# EAGLE design eagle (EAGLE 9.6.2)
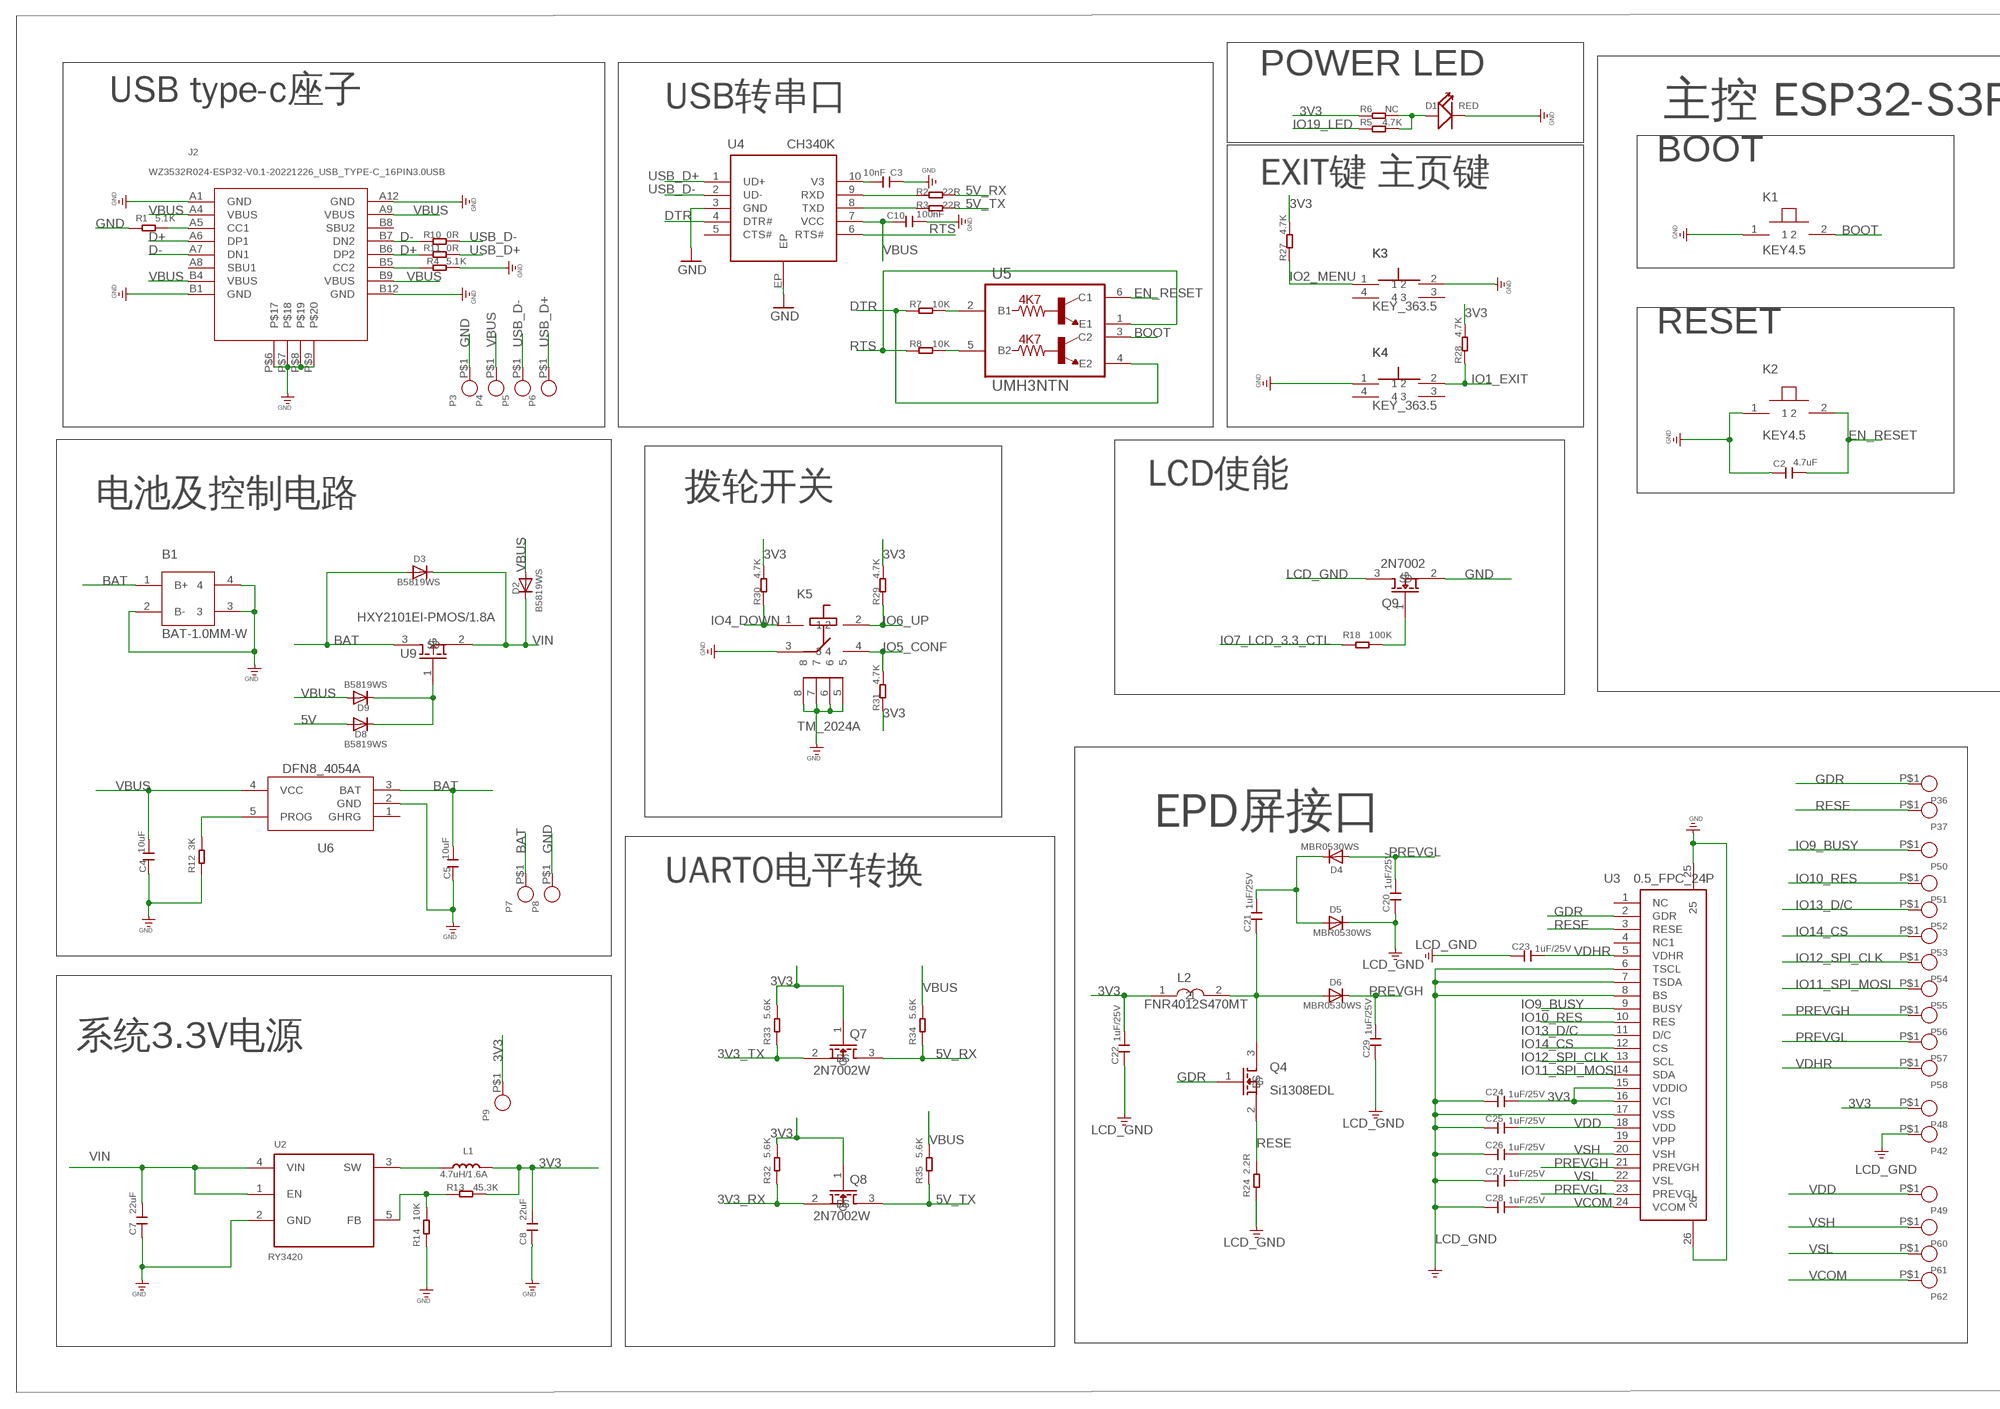
[diagram p0: schematic, sheet 1, part 1 of 2]
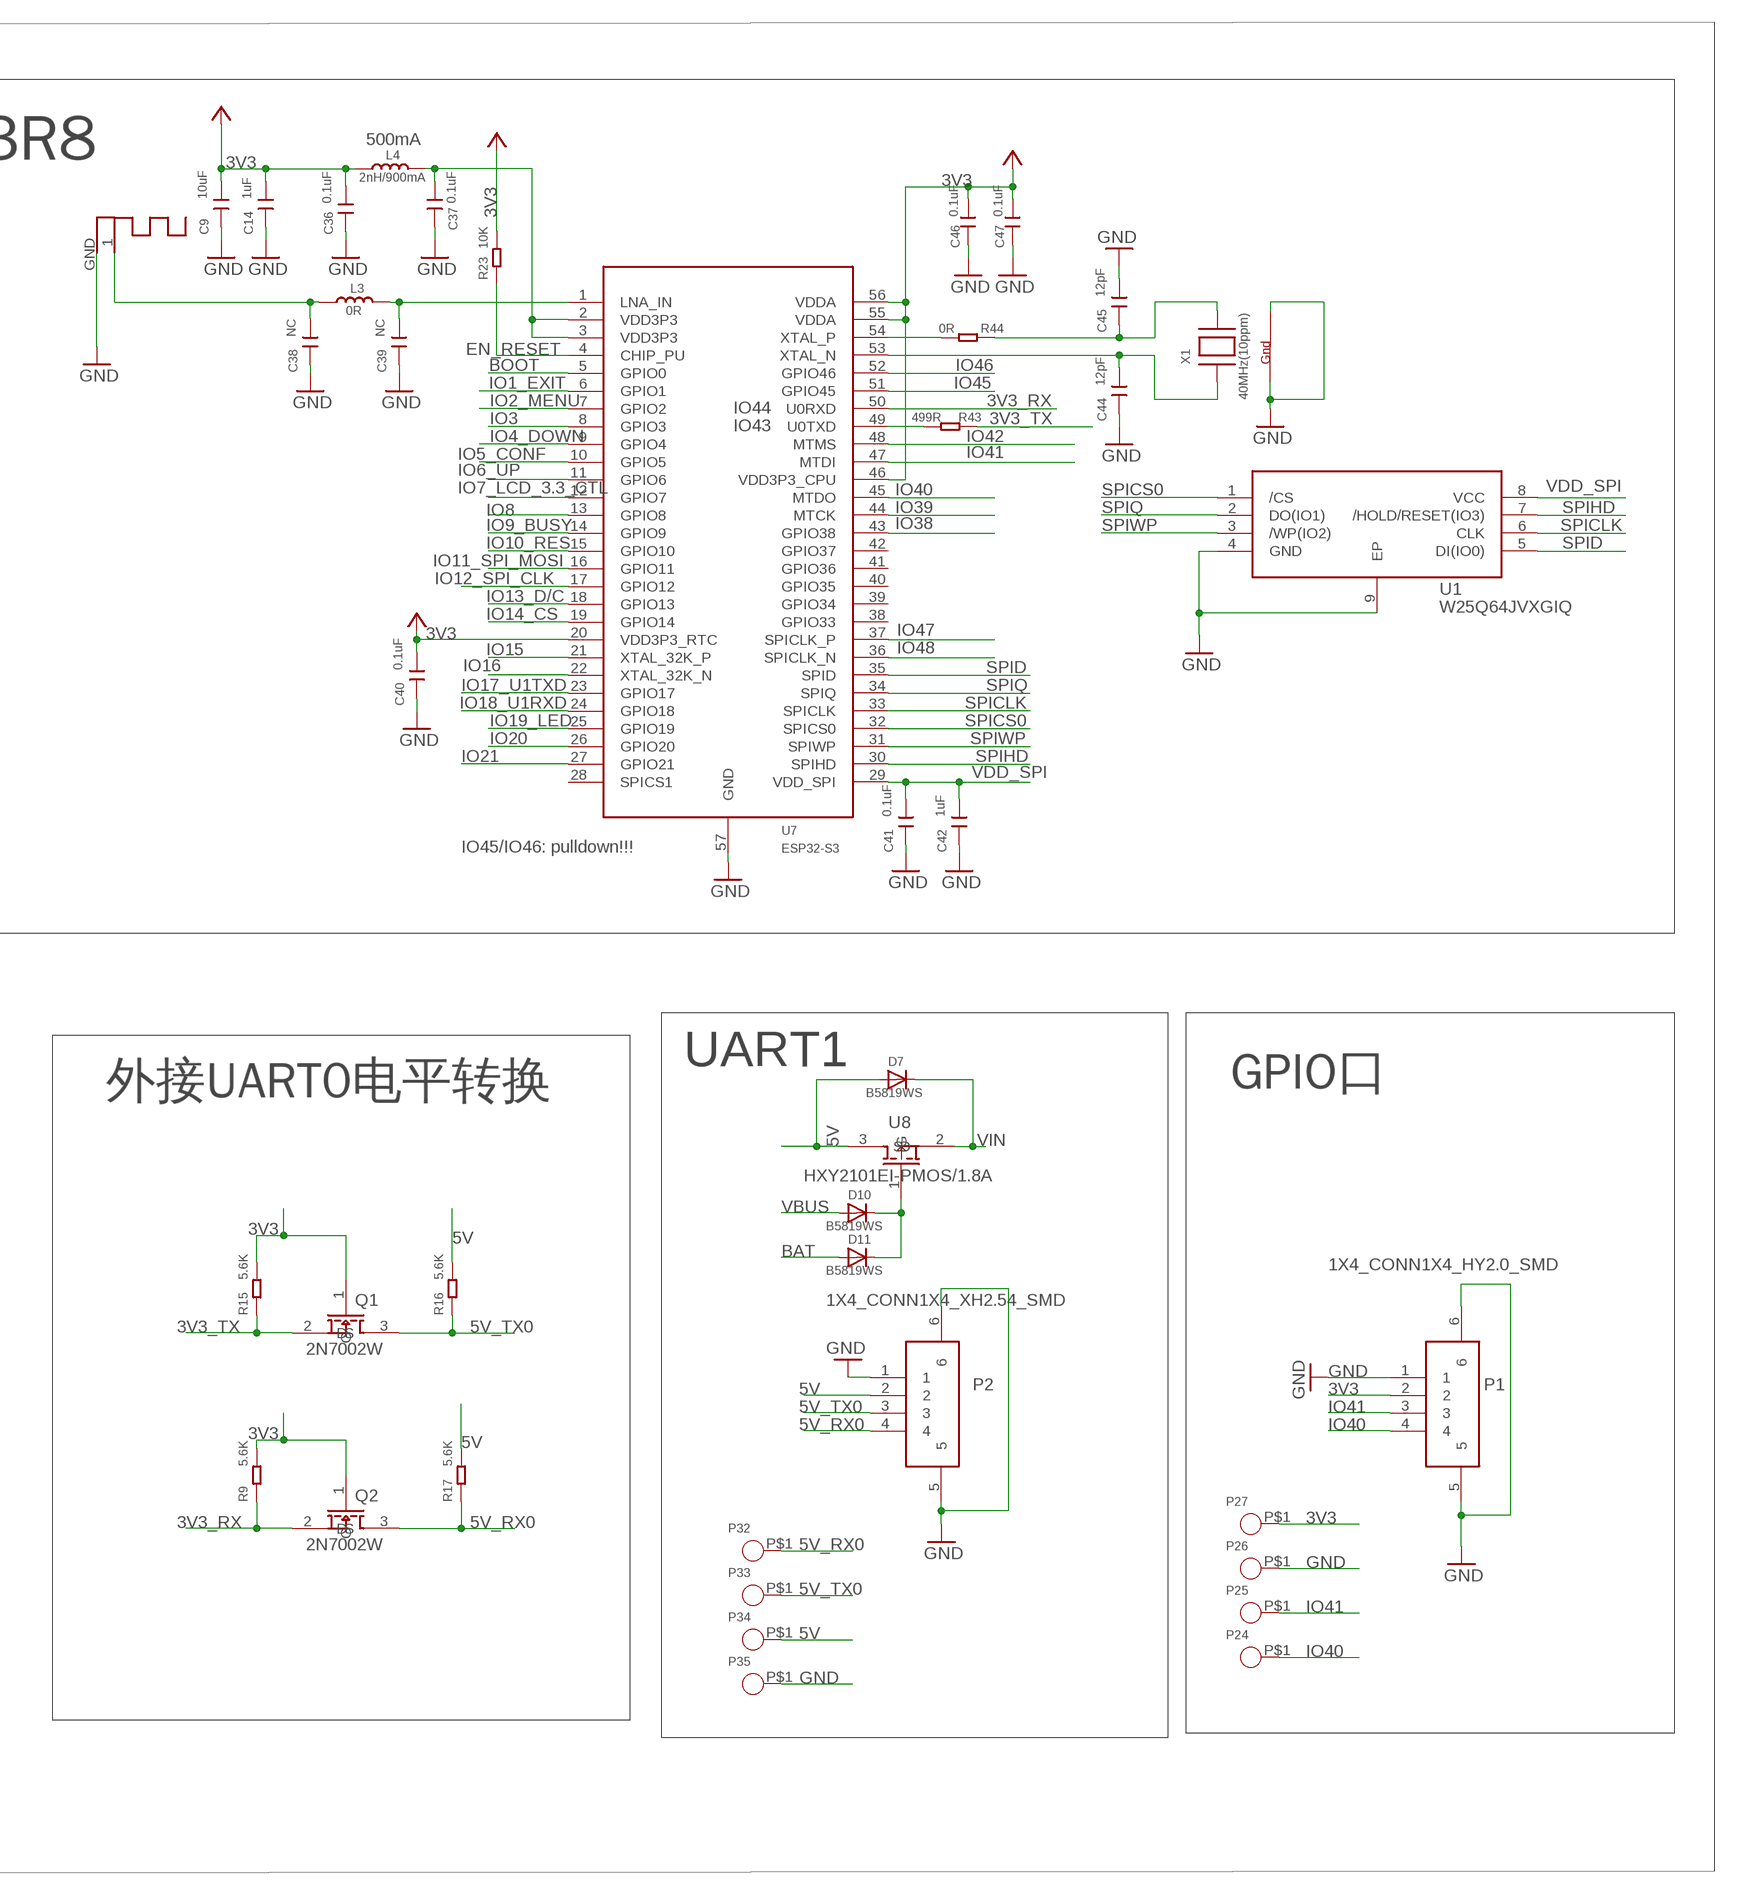
[diagram p1: schematic, sheet 1, part 2 of 2]

## Parts
ANT1  ADAFRUIT_ANTENNA  [ADAFRUIT_RN-ANT]
B1  BAT-1.0MM-W  [SH1.0MM-W]
C2  4.7uF  C0402_W  [0402]
C3  10nF  C0402_W  [0402]
C4  10uF  C0402_W  [0402]
C5  10uF  C0402_W  [0402]
C7  22uF  C0603  [0603]
C8  22uF  C0603  [0603]
C9  10uF  C0402_W  [0402]
C10  100nF  C0402_W  [0402]
C14  1uF  C0402_W  [0402]
C20  1uF/25V  C0402_W  [0402]
C21  1uF/25V  C0402_W  [0402]
C22  1uF/25V  C0402_W  [0402]
C23  1uF/25V  C0402_W  [0402]
C24  1uF/25V  C0402_W  [0402]
C25  1uF/25V  C0402_W  [0402]
C26  1uF/25V  C0402_W  [0402]
C27  1uF/25V  C0402_W  [0402]
C28  1uF/25V  C0402_W  [0402]
C29  1uF/25V  C0402_W  [0402]
C36  0.1uF  C0402_W  [0402]
C37  0.1uF  C0402_W  [0402]
C38  NC  C0402_W  [0402]
C39  NC  C0402_W  [0402]
C40  0.1uF  C0402_W  [0402]
C41  0.1uF  C0402_W  [0402]
C42  1uF  C0402_W  [0402]
C44  12pF  C0402_W  [0402]
C45  12pF  C0402_W  [0402]
C46  0.1uF  C0402_W  [0402]
C47  0.1uF  C0402_W  [0402]
D1  RED  A_XBJ_DISCRETE_LED0603  [A_XBJ_DISCRETE_LED-0603]
D2  B5819WS  [DISCRETE_SOD323]
D3  B5819WS  [DISCRETE_SOD323]
D4  MBR0530WS  B5819WS  [DISCRETE_SOD323]
D5  MBR0530WS  B5819WS  [DISCRETE_SOD323]
D6  MBR0530WS  B5819WS  [DISCRETE_SOD323]
D7  B5819WS  [DISCRETE_SOD323]
D8  B5819WS  [DISCRETE_SOD323]
D9  B5819WS  [DISCRETE_SOD323]
D10  B5819WS  [DISCRETE_SOD323]
D11  B5819WS  [DISCRETE_SOD323]
J2  WZ3532R024-ESP32-V0.1-20221226_USB_TYPE-C_16PIN3.0USB  [WZ3532R024-ESP32-V0.1-20221226_KEVIN_3.0TYPEC-SMD]
K1  KEY4.5  [KEY-4.5]
K2  KEY4.5  [KEY-4.5]
K3  KEY_363.5  [KEY_3*6*3.5]
K4  KEY_363.5  [KEY_3*6*3.5]
K5  TM_2024A  [TM_2024A]
L1  4.7uH/1.6A  A9G_DISCRETE_L0805  [A9G_DISCRETE_L0805]
L2  FNR4012S470MT  [FNR4012S470MT]
L3  0R  L0402  [L0402]
L4  2nH/900mA  L0402  [L0402]
P1  1X4_CONN1X4_HY2.0_SMD  [CONN-SMD-4P-P2.0]
P2  1X4_CONN1X4_XH2.54_SMD  [CONN-SMD-4P-P2.54]
P3  CROWPI_POW_PADPAD-1.0MM  [CROWPI_POW_PAD-1.0MM]
P4  CROWPI_POW_PADPAD-1.0MM  [CROWPI_POW_PAD-1.0MM]
P5  CROWPI_POW_PADPAD-1.0MM  [CROWPI_POW_PAD-1.0MM]
P6  CROWPI_POW_PADPAD-1.0MM  [CROWPI_POW_PAD-1.0MM]
P7  CROWPI_POW_PADPAD-1.0MM  [CROWPI_POW_PAD-1.0MM]
P8  CROWPI_POW_PADPAD-1.0MM  [CROWPI_POW_PAD-1.0MM]
P9  CROWPI_POW_PADPAD-1.0MM  [CROWPI_POW_PAD-1.0MM]
P24  CROWPI_POW_PADPAD-1.0MM  [CROWPI_POW_PAD-1.0MM]
P25  CROWPI_POW_PADPAD-1.0MM  [CROWPI_POW_PAD-1.0MM]
P26  CROWPI_POW_PADPAD-1.0MM  [CROWPI_POW_PAD-1.0MM]
P27  CROWPI_POW_PADPAD-1.0MM  [CROWPI_POW_PAD-1.0MM]
P32  CROWPI_POW_PADPAD-1.0MM  [CROWPI_POW_PAD-1.0MM]
P33  CROWPI_POW_PADPAD-1.0MM  [CROWPI_POW_PAD-1.0MM]
P34  CROWPI_POW_PADPAD-1.0MM  [CROWPI_POW_PAD-1.0MM]
P35  CROWPI_POW_PADPAD-1.0MM  [CROWPI_POW_PAD-1.0MM]
P36  CROWPI_POW_PADPAD-1.0MM  [CROWPI_POW_PAD-1.0MM]
P37  CROWPI_POW_PADPAD-1.0MM  [CROWPI_POW_PAD-1.0MM]
P42  CROWPI_POW_PADPAD-1.0MM  [CROWPI_POW_PAD-1.0MM]
P48  CROWPI_POW_PADPAD-1.0MM  [CROWPI_POW_PAD-1.0MM]
P49  CROWPI_POW_PADPAD-1.0MM  [CROWPI_POW_PAD-1.0MM]
P50  CROWPI_POW_PADPAD-1.0MM  [CROWPI_POW_PAD-1.0MM]
P51  CROWPI_POW_PADPAD-1.0MM  [CROWPI_POW_PAD-1.0MM]
P52  CROWPI_POW_PADPAD-1.0MM  [CROWPI_POW_PAD-1.0MM]
P53  CROWPI_POW_PADPAD-1.0MM  [CROWPI_POW_PAD-1.0MM]
P54  CROWPI_POW_PADPAD-1.0MM  [CROWPI_POW_PAD-1.0MM]
P55  CROWPI_POW_PADPAD-1.0MM  [CROWPI_POW_PAD-1.0MM]
P56  CROWPI_POW_PADPAD-1.0MM  [CROWPI_POW_PAD-1.0MM]
P57  CROWPI_POW_PADPAD-1.0MM  [CROWPI_POW_PAD-1.0MM]
P58  CROWPI_POW_PADPAD-1.0MM  [CROWPI_POW_PAD-1.0MM]
P60  CROWPI_POW_PADPAD-1.0MM  [CROWPI_POW_PAD-1.0MM]
P61  CROWPI_POW_PADPAD-1.0MM  [CROWPI_POW_PAD-1.0MM]
P62  CROWPI_POW_PADPAD-1.0MM  [CROWPI_POW_PAD-1.0MM]
Q1  2N7002W  [SOT-323_W]
Q2  2N7002W  [SOT-323_W]
Q4  Si1308EDL  HXY2102EI  [SOT-323_W]
Q7  2N7002W  [SOT-323_W]
Q8  2N7002W  [SOT-323_W]
Q9  2N7002  NMOS_W  [SOT23-3_W]
R1  5.1K  R0402-1  [0402]
R2  22R  R0402-1  [0402]
R3  22R  R0402-1  [0402]
R4  5.1K  R0402-1  [0402]
R5  4.7K  R0402-1  [0402]
R6  NC  R0402-1  [0402]
R7  10K  R0402-1  [0402]
R8  10K  R0402-1  [0402]
R9  5.6K  R0402-1  [0402]
R10  0R  R0402-1  [0402]
R11  0R  R0402-1  [0402]
R12  3K  R0402-1  [0402]
R13  45.3K  R0402-1  [0402]
R14  10K  R0402-1  [0402]
R15  5.6K  R0402-1  [0402]
R16  5.6K  R0402-1  [0402]
R17  5.6K  R0402-1  [0402]
R18  100K  R0402-1  [0402]
R23  10K  R0402-1  [0402]
R24  2.2R  R0402-1  [0402]
R27  4.7K  R0402-1  [0402]
R28  4.7K  R0402-1  [0402]
R29  4.7K  R0402-1  [0402]
R30  4.7K  R0402-1  [0402]
R31  4.7K  R0402-1  [0402]
R32  5.6K  R0402-1  [0402]
R33  5.6K  R0402-1  [0402]
R34  5.6K  R0402-1  [0402]
R35  5.6K  R0402-1  [0402]
R43  499R  R0402-1  [0402]
R44  0R  R0402-1  [0402]
U1  W25Q64JVXGIQ  [XSON-EP(4×4)]
U2  RY3420  CROWBOT_-V1.0-20220525_A_XBJ_HM3420B  [CROWBOT_-V1.0-20220525_A_XBJ_SOT23-5]
U3  0.5_FPC_24P  [0.5_FPC_24P]
U4  CH340K  [ESOP-10-EP-150MIL]
U5  UMH3NTN  [SOP65P210X100-6N]
U6  DFN8_4054A  [DFN8_SOP23-5]
U7  ESP32-S3  [QFN56-7*7MM]
U8  HXY2101EI-PMOS/1.8A  HXY2101EI-PMOS  [SOT-323_W]
U9  HXY2101EI-PMOS/1.8A  HXY2101EI-PMOS  [SOT-323_W]
X1  40MHz(10ppm)  ADAFRUIT_XTAL-4-3225  [ADAFRUIT_NX3225]

## Nets
3V3: C8.2 C9.2 C14.2 C22.1 C24.1 C36.2 C40.2 C46.2 C47.2 L1.2 L2.1 L4.1 P1.2 P9.P$1 P27.P$1 P48.P$1 Q1.1(G) Q2.1(G) Q7.1(G) Q8.1(G) R6.2 R9.2 R13.2 R15.2 R23.2 R27.2 R28.2 R29.2 R30.2 R31.1 R32.2 R33.2 U3.15(VDDIO) U3.16(VCI) U7.20(VDD3P3_RTC) U7.46(VDD3P3_CPU) U7.55(VDDA) U7.56(VDDA) ; supply symbol labelled +3V3
3V3_RX: Q2.2(S) Q8.2(S) R9.1 R32.1 U7.50(U0RXD)
3V3_TX: Q1.2(S) Q7.2(S) R15.1 R33.1 R43.1
5V: D7.+(A) D8.+(A) P2.2 P34.P$1 R16.2 R17.2 U8.3(D)
5V_RX: Q7.3(D) R2.2 R34.1
5V_RX0: P2.4 P32.P$1 Q2.3(D) R17.1
5V_TX: Q8.3(D) R3.2 R35.1
5V_TX0: P2.3 P33.P$1 Q1.3(D) R16.1
BAT: B1.1(B+) C5.2 D3.+(A) D11.+(A) P7.P$1 U6.3(BAT) U9.3(D)
BOOT: K1.2 U5.3(C2) U7.5(GPIO0)
D+: J2.A6(DP1) J2.B6(DP2) R11.1
D-: J2.A7(DN1) J2.B7(DN2) R10.1
DTR: R7.1 U4.4(DTR#) U5.4(E2)
EN_RESET: C2.2 K2.2 R23.1 U5.6(C1) U7.4(CHIP_PU)
GDR: P36.P$1 Q4.1(G) U3.2(GDR)
GND: ANT1.GND B1.2(B-) B1.3 B1.4 C2.1 C3.1 C4.1 C5.1 C7.1 C8.1 C9.1 C10.2 C14.1 C36.1 C37.1 C38.1 C39.1 C40.1 C41.1 C42.1 C44.1 C45.2 C46.1 C47.1 D1.- J2.A1(GND) J2.A12(GND) J2.B1(GND) J2.B12(GND) J2.P$6 J2.P$7 J2.P$8 J2.P$9 K1.1 K2.1 K3.2 K4.1 K5.3 K5.5 K5.6 K5.7 K5.8 P1.1 P1.5 P1.6 P2.1 P2.5 P2.6 P3.P$1 P8.P$1 P26.P$1 P35.P$1 Q9.2(S) R1.1 R4.2 R12.1 R14.1 U1.4(GND) U1.9(EP) U2.2(GND) U3.25 U3.26 U4.3(GND) U4.EP U6.2(GND) U7.57(GND) X1.2(G2) X1.4(G1)
IO1_EXIT: K4.2 R28.1 U7.6(GPIO1)
IO2_MENU: K3.1 R27.1 U7.7(GPIO2)
IO3: U7.8(GPIO3)
IO4_DOWN: K5.1 R30.1 U7.9(GPIO4)
IO5_CONF: K5.4 R31.2 U7.10(GPIO5)
IO6_UP: K5.2 R29.1 U7.11(GPIO6)
IO7_LCD_3.3_CTL: R18.1 U7.12(GPIO7)
IO8: U7.13(GPIO8)
IO9_BUSY: P50.P$1 U3.9(BUSY) U7.14(GPIO9)
IO10_RES: P51.P$1 U3.10(RES) U7.15(GPIO10)
IO11_SPI_MOSI: P55.P$1 U3.14(SDA) U7.16(GPIO11)
IO12_SPI_CLK: P54.P$1 U3.13(SCL) U7.17(GPIO12)
IO13_D/C: P52.P$1 U3.11(D/C) U7.18(GPIO13)
IO14_CS: P53.P$1 U3.12(CS) U7.19(GPIO14)
IO15: U7.21(XTAL_32K_P)
IO16: U7.22(XTAL_32K_N)
IO17_U1TXD: U7.23(GPIO17)
IO18_U1RXD: U7.24(GPIO18)
IO19_LED: R5.2 U7.25(GPIO19)
IO20: U7.26(GPIO20)
IO21: U7.27(GPIO21)
IO38: U7.43(GPIO38)
IO39: U7.44(MTCK)
IO40: P1.4 P24.P$1 U7.45(MTDO)
IO41: P1.3 P25.P$1 U7.47(MTDI)
IO42: U7.48(MTMS)
IO45: U7.51(GPIO45)
IO46: U7.52(GPIO46)
IO47: U7.37(SPICLK_P)
IO48: U7.36(SPICLK_N)
LCD_GND: C20.2 C22.2 C23.2 C24.2 C25.2 C26.2 C27.2 C28.2 C29.2 D5.-(C) P42.P$1 Q9.3(D) R24.1 U3.6(TSCL) U3.7(TSDA) U3.8(BS) U3.17(VSS) ; supply symbol labelled GND
N$1: R7.2 U5.2(B1)
N$2: D10.-(C) D11.-(C) U8.1(G)
N$3: R8.2 U5.5(B2)
N$5: J2.A5(CC1) R1.2
N$6: D8.-(C) D9.-(C) U9.1(G)
N$7: Q9.1(G) R18.2
N$8: R3.1 U4.8(TXD)
N$9: R13.1 R14.2 U2.5(FB)
N$10: C3.2 U4.10(V3)
N$11: L1.1 U2.3(SW)
N$12: J2.B5(CC2) R4.1
N$16: R12.2 U6.5(PROG)
N$25: D1.+ R5.1 R6.1
N$30: ANT1.1(FEED) C38.2 L3.1
N$31: C39.2 L3.2 U7.1(LNA_IN)
N$33: C37.2 L4.2 U7.2(VDD3P3) U7.3(VDD3P3)
N$36: R2.1 U4.9(RXD)
N$37: R44.2 U7.54(XTAL_P)
N$55: C21.1 D4.-(C) D5.+(A)
N$56: C21.2 D6.+(A) L2.2 Q4.3(D)
N$63: R43.2 U7.49(U0TXD)
N$65: C44.2 U7.53(XTAL_N) X1.1(X1)
N$66: C45.1 R44.1 X1.3(X2)
PREVGH: C29.1 D6.-(C) P56.P$1 U3.21(PREVGH)
PREVGL: C20.1 D4.+(A) P57.P$1 U3.23(PREVGL)
RESE: P37.P$1 Q4.2(S) R24.2 U3.3(RESE)
RTS: R8.1 U4.6(RTS#) U5.1(E1)
SPICLK: U1.6(CLK) U7.33(SPICLK)
SPICS0: U1.1(/CS) U7.32(SPICS0)
SPID: U1.5(DI(IO0)) U7.35(SPID)
SPIHD: U1.7(/HOLD/RESET(IO3)) U7.30(SPIHD)
SPIQ: U1.2(DO(IO1)) U7.34(SPIQ)
SPIWP: U1.3(/WP(IO2)) U7.31(SPIWP)
USB_D+: P6.P$1 R11.2 U4.1(UD+)
USB_D-: P5.P$1 R10.2 U4.2(UD-)
VBUS: C4.2 C10.1 D2.+(A) D9.+(A) D10.+(A) J2.A4(VBUS) J2.A9(VBUS) J2.B4(VBUS) J2.B9(VBUS) P4.P$1 R34.2 R35.2 U4.7(VCC) U6.4(VCC)
VCOM: C28.1 P62.P$1 U3.24(VCOM)
VDD: C25.1 P49.P$1 U3.18(VDD)
VDD_SPI: C41.2 C42.2 U1.8(VCC) U7.29(VDD_SPI)
VDHR: C23.1 P58.P$1 U3.5(VDHR)
VIN: C7.2 D2.-(C) D3.-(C) D7.-(C) U2.1(EN) U2.4(VIN) U8.2(S) U9.2(S)
VSH: C26.1 P60.P$1 U3.20(VSH)
VSL: C27.1 P61.P$1 U3.22(VSL)
Unconnected: J2.A8(SBU1) J2.B8(SBU2) K3.3 K3.4 K4.3 K4.4 U3.1(NC) U3.4(NC1) U3.19(VPP) U4.5(CTS#) U6.1(GHRG) U7.28(SPICS1) U7.38(GPIO33) U7.39(GPIO34) U7.40(GPIO35) U7.41(GPIO36) U7.42(GPIO37)

## Notes on the sheet
- POWER LED
- USB type-c座子 | USB转串口 | 500mA
- 主控 ESP32-S3R8
- BOOT
- EXIT键 主页键
- IO44
- IO43
- RESET
- LCD使能
- 电池及控制电路 | 拨轮开关
- IO45/IO46: pulldown!!!
- UART1
- 外接UART0电平转换 | GPIO口
- EPD屏接口
- UART0电平转换
- 系统3.3V电源

## Library data of the parts
ANT1 = ESP32-S3 4.2“ EINK V1.3:ADAFRUIT_ANTENNA
B1 = WGH:BAT-1.0MM-W
C2-C5 C9 C10 C14 C20-C29 C36-C42 C44-C47 = WGH:C0402_W
C7 C8 = WGH:C0603
D1 = CrowPanel ESP32 Display-4.3-inch-V2.1-20240314:A_XBJ_DISCRETE_LED*
D2-D11 = ESP32-S3 4.2“ EINK V1.3:B5819WS
J2 = CrowPanel ESP32 Display-4.3-inch-V2.1-20240314:WZ3532R024-ESP32-V0.1-20221226_USB_TYPE-C_16PIN
K1 K2 = WGH:KEY4.5
K3 K4 = WGH:KEY_3*6*3.5
K5 = WGH:TM_2024A
L1 = ESP32-S3 4.2“ EINK V1.3:A9G_DISCRETE_L*
L2 = WGH:FNR4012S470MT
L3 L4 = SX1302_Module:L*
P1 P2 = Connecting_base:1X4_CONN
P3-P9 P24-P27 P32-P37 P42 P48-P58 P60-P62 = ESP32 Terminal - 3.5 Inch_2.0:CROWPI_POW_PAD*
Q1 Q2 Q7 Q8 = WGH:2N7002W
Q4 = WGH:HXY2102EI
Q9 = WGH:NMOS_W
R1-R18 R23 R24 R27-R35 R43 R44 = WGH:R0402-1
U1 = ESP32-S3 4.2“ EINK V1.3:W25Q64JVXGIQ
U2 = CrowPanel ESP32 Display-4.3-inch-V2.1-20240314:CROWBOT_-V1.0-20220525_A_XBJ_HM3420B
U3 = ESP32 Terminal - 3.5 Inch_2.0:0.5_FPC_24P
U4 = sale:CH340K
U5 = UMH3NTN:UMH3NTN: Dual NPN BJT with 4.7K Base resistor Datasheet <https://fscdn.rohm.com/en/products/databook/datasheet/discrete/transistor/digital/umh3ntn-e.pdf> BUY NOW <https://www.digikey.ca/en/products/detail/rohm-semiconductor/umh3ntn/659279> Check availability <https://pricing.snapeda.com/parts/UMH3NTN/Rohm/view-part?ref=eda>; AVAILABILITY: In Stock; CHECK_PRICES: https://www.snapeda.com/parts/UMH3NTN/Rohm/view-part/?ref=eda; DESCRIPTION: Pre-Biased Bipolar Transistor (BJT) 2 NPN - Pre-Biased (Dual) 50V 100mA 250MHz 150mW Surface Mount UMT6; MF: Rohm; MP: UMH3NTN; PACKAGE: SOT-363 Rohm; PRICE: None; PURCHASE-URL: https://www.snapeda.com/api/url_track_click_mouser/?unipart_id=355768&manufacturer=Rohm&part_name=UMH3NTN&search_term=umh3n; SNAPEDA_LINK: https://www.snapeda.com/parts/UMH3NTN/Rohm/view-part/?ref=snap
U6 = CrowPanel ESP32 Display-4.3-inch-V2.1-20240314:DFN8_4054A
U7 = sale:ESP32-S3
U8 U9 = WGH:HXY2101EI-PMOS
X1 = ESP32-S3 4.2“ EINK V1.3:ADAFRUIT_XTAL-4: Classic 4-pin 3.2 x 2.5mm crystal

## Net classes
0 default: width 0.203 mm, drill 0.305 mm, clearance 0.152 mm

## Board
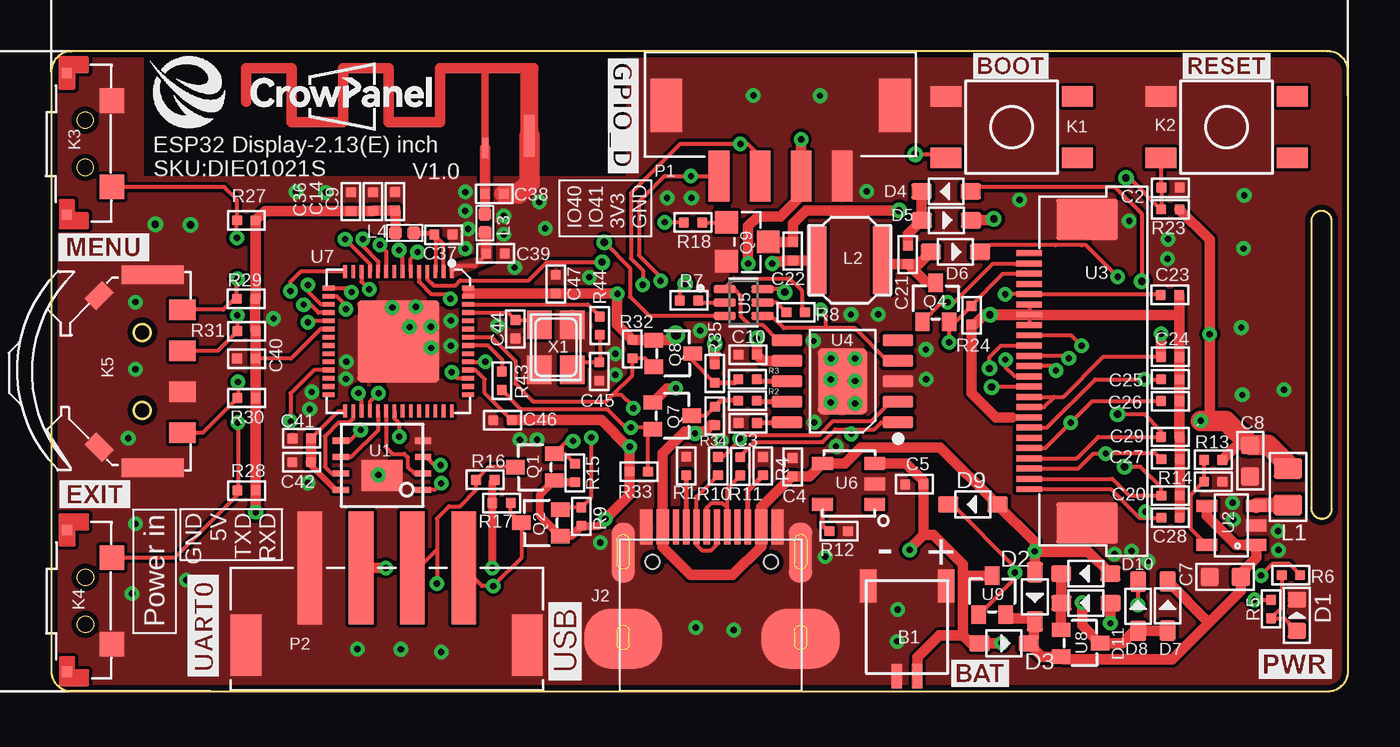
[diagram p2: board, top side]
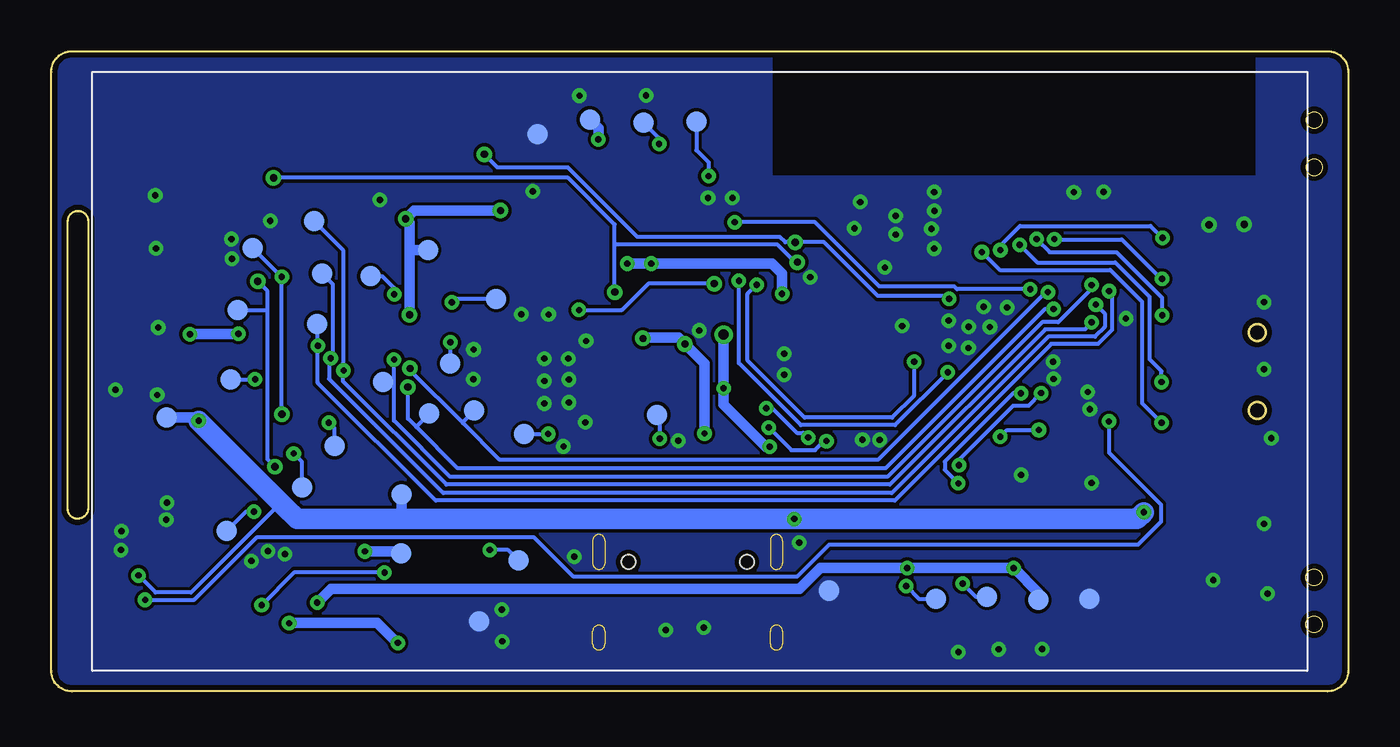
[diagram p3: board, bottom side, seen from below]

Size 63.2 x 31.2 mm. Coordinates in mm from the lower left corner, seen from the top.
Outline: 0,30.2 0,1 arc90 1,0 62.2,0 arc90 63.2,1 63.2,30.2 arc90 62.2,31.2 1,31.2 arc90 0,30.2
Outline: 62.4,8.89 62.39,22.93 arc90 61.9,23.42 arc90 61.4,22.92 61.4,8.93 arc90 61.92,8.41 arc90 62.4,8.89
Copper layers (1*16): Top 0.035mm / dielectric 1.5mm / Bottom 0.035mm
Design rules "default *": minimum track width 6mil, minimum drill 12mil, track to track 6mil, track to pad 6mil, pad to pad 6mil, via to via 6mil, smd to smd 6mil, copper to edge 10mil, drill to drill 6mil, minimum pad ring 10mil, minimum via ring 8mil, stop-mask expansion 4mil, vias tented up to drill 100mil, thermal gap 0mil
tRestrict: area 4.5,25.1 to 28,31.1
bRestrict: area 4.5,25.2 to 28,31.2

### Footprints (pad centres in the part's own frame; a part is rotated, then mirrored left to right if it is on the bottom)
ADAFRUIT_RN-ANT = smd 1 x 0.3: 1 0.5,2.159 | smd 2.032 x 0.508: GND 1.1,0
SH1.0MM-W = smd 0.5 x 1.2: 1 -0.5,2.4; 2 0.5,2.4 | smd 0.8 x 1.6: 3 -1.9,-2; 4 1.9,-2
0402 = smd 0.5 x 0.5: 1 -0.45,0; 2 0.45,0
0603 = smd 0.889 x 0.889: 1 -0.762,0; 2 0.762,0
A_XBJ_DISCRETE_LED-0603 = smd 0.762 x 0.889: + -0.762,0; - 0.762,0
DISCRETE_SOD323 = smd 1 x 0.8: + -1.2,0; - 1.2,0
WZ3532R024-ESP32-V0.1-20221226_KEVIN_3.0TYPEC-SMD = smd 0.3 x 1.7: A1 -3.35,0.5; A4 -2.55,0.5; A5 -1.25,0.5; A6 -0.25,0.5; A7 0.25,0.5; A8 1.25,0.5; A9 2.55,0.5; A12 3.35,0.5; B1 3.05,0.5; B4 2.25,0.5; B5 1.75,0.5; B6 0.75,0.5; B7 -0.75,0.5; B8 -1.75,0.5; B9 -2.25,0.5; B12 -3.05,0.5 | smd 1.143 x 2.921: P$6 -4.318,-0.762; P$7 4.318,-0.762 | smd 3.81 x 2.921: P$8 -4.318,-4.953; P$9 4.318,-4.953 | hole 0.68: -2.89,-1.22; 2.89,-1.22
KEY-4.5 = smd 1.5 x 1: 1 -3.2,1.5; 2 -3.2,-1.5; 3 3.2,-1.5; 4 3.2,1.5
KEY_3*6*3.5 = smd 1.2 x 1.2: 1 -2.1,-2.6; 2 2.1,-2.6 | smd 0.5 x 0.5: 3 3.45,-0.4; 4 -3.45,-0.4
TM_2024A = smd 1 x 1.3: 1 -3,0.65; 2 3,0.65; 3 -1,0.65; 4 1,0.65 | smd 0.9 x 3: 5 -4.7,2.1; 6 4.7,2.1 | smd 1.2 x 0.8 rotated 45: 7 -3.7,4.7 | smd 1.2 x 0.8 rotated 135: 8 3.7,4.7
A9G_DISCRETE_L0805 = smd 1.016 x 1.397: 1 -0.889,0; 2 0.889,0
FNR4012S470MT = smd 0.95 x 3.3: 1 -1.6,0; 2 1.6,0
L0402 = smd 0.635 x 0.635: 1 -0.445,0; 2 0.445,0
CONN-SMD-4P-P2.0 = smd 1 x 2.5: 1 -2.998,1.723; 2 -0.998,1.723; 3 1.004,1.723; 4 3.002,1.723 | smd 1.55 x 2.6: 5 5.57,-1.725; 6 -5.57,-1.725
CONN-SMD-4P-P2.54 = smd 1.2 x 5.5: 1 -3.75,1.875; 2 -1.25,1.875; 3 1.25,1.875; 4 3.75,1.875 | smd 1.5 x 3: 5 6.85,-1.875; 6 -6.85,-1.875
CROWPI_POW_PAD-1.0MM = smd 1 x 1: P$1 0,0
SOT-323_W = smd 0.7 x 0.9: 1 -0.65,-0.95; 2 0.65,-0.95; 3 0,0.95
SOT23-3_W = smd 1.1 x 1.1: 1 -0.95,-1.016; 2 0.95,-1.016; 3 0,1.016
XSON-EP(4×4) = smd 0.8 x 0.3: 1 -2,1.2; 2 -2,0.4; 3 -2,-0.4; 4 -2,-1.2; 5 2,-1.2; 6 2,-0.4; 7 2,0.4; 8 2,1.2 | smd 2 x 1.5: 9 0,0.5
CROWBOT_-V1.0-20220525_A_XBJ_SOT23-5 = smd 0.6 x 1: 1 -0.95,-1.2; 2 0,-1.2; 3 0.95,-1.2; 4 0.95,1.2; 5 -0.95,1.2
0.5_FPC_24P = smd 1.3 x 0.3: 1 -2.54,5.75; 2 -2.54,5.25; 3 -2.54,4.75; 4 -2.54,4.25; 5 -2.54,3.75; 6 -2.54,3.25; 7 -2.54,2.75; 8 -2.54,2.25; 9 -2.54,1.75; 10 -2.54,1.25; 11 -2.54,0.75; 12 -2.54,0.25; 13 -2.54,-0.25; 14 -2.54,-0.75; 15 -2.54,-1.25; 16 -2.54,-1.75; 17 -2.54,-2.25; 18 -2.54,-2.75; 19 -2.54,-3.25; 20 -2.54,-3.75; 21 -2.54,-4.25; 22 -2.54,-4.75; 23 -2.54,-5.25; 24 -2.54,-5.75 | smd 3 x 2: 25 0.27,-7.4; 26 0.27,7.4
ESOP-10-EP-150MIL = smd 1.5 x 0.6: 1 -2.7,2; 2 -2.7,1; 3 -2.7,0; 4 -2.7,-1; 5 -2.7,-2; 6 2.7,-2; 7 2.7,-1; 8 2.7,0; 9 2.7,1; 10 2.7,2 | smd 2.4 x 3.2: EP 0,0
SOP65P210X100-6N = smd 1.09 x 0.4: 1 -0.92,0.65; 2 -0.92,0; 3 -0.92,-0.65; 4 0.92,-0.65; 5 0.92,0; 6 0.92,0.65
DFN8_SOP23-5 = smd 1 x 0.635: 1 -1.27,1; 2 -1.27,0; 3 -1.27,-1; 4 1.27,-1; 5 1.27,1
QFN56-7*7MM = smd 0.6 x 0.2: 1 -3.4,2.6; 2 -3.4,2.2; 3 -3.4,1.8; 4 -3.4,1.4; 5 -3.4,1; 6 -3.4,0.6; 7 -3.4,0.2; 8 -3.4,-0.2; 9 -3.4,-0.6; 10 -3.4,-1; 11 -3.4,-1.4; 12 -3.4,-1.8; 13 -3.4,-2.2; 14 -3.4,-2.6; 29 3.4,-2.6; 30 3.4,-2.2; 31 3.4,-1.8; 32 3.4,-1.4; 33 3.4,-1; 34 3.4,-0.6; 35 3.4,-0.2; 36 3.4,0.2; 37 3.4,0.6; 38 3.4,1; 39 3.4,1.4; 40 3.4,1.8; 41 3.4,2.2; 42 3.4,2.6 | smd 0.2 x 0.6: 15 -2.6,-3.4; 16 -2.2,-3.4; 17 -1.8,-3.4; 18 -1.4,-3.4; 19 -1,-3.4; 20 -0.6,-3.4; 21 -0.2,-3.4; 22 0.2,-3.4; 23 0.6,-3.4; 24 1,-3.4; 25 1.4,-3.4; 26 1.8,-3.4; 27 2.2,-3.4; 28 2.6,-3.4; 43 2.6,3.4; 44 2.2,3.4; 45 1.8,3.4; 46 1.4,3.4; 47 1,3.4; 48 0.6,3.4; 49 0.2,3.4; 50 -0.2,3.4; 51 -0.6,3.4; 52 -1,3.4; 53 -1.4,3.4; 54 -1.8,3.4; 55 -2.2,3.4; 56 -2.6,3.4 | smd 4 x 4: 57 0,0
ADAFRUIT_NX3225 = smd 1.4 x 1.2: 1 -1.1,-0.8; 2 1.1,-0.8; 3 1.1,0.8; 4 -1.1,0.8

### Placement (x,y rotation side)
ANT1  23.3,25.99 90 top
B1  41.7,3.14 180 top
C2  54.54,24.55 180 top
C3  33.94,13.08 0 top
C4  36.12,10.93 270 top
C5  42.06,10.09 0 top
C7  57.2,5.58 0 top
C8  58.42,11.24 90 top
C9  16.75,23.88 270 top
C10  33.94,16.4 180 top
C14  15.68,23.87 270 top
C20  54.54,9.54 0 top
C21  41.74,21.28 270 top
C22  36.14,21.45 90 top
C23  54.51,19.32 0 top
C24  54.53,16.3 0 top
C25  54.53,15.21 0 top
C26  54.53,14.15 0 top
C27  54.54,11.31 0 top
C28  54.54,8.46 0 top
C29  54.53,12.4 0 top
C36  14.61,23.87 270 top
C37  19.11,22.26 180 top
C38  21.59,24.26 180 top
C39  21.65,21.34 180 top
C40  9.51,16.22 0 top
C41  12.21,12.33 0 top
C42  12.2,11.17 0 top
C44  22.62,17.65 90 top
C45  26.71,15.59 270 top
C46  21.99,13.22 0 top
C47  24.59,19.85 270 top
D1  60.7,3.71 90 top
D2  47.93,4.61 270 top
D3  46.43,2.34 0 top
D4  43.61,24.37 180 top
D5  43.62,22.96 0 top
D6  44.06,21.42 0 top
D7  54.4,4.16 90 top
D8  52.96,4.15 90 top
D9  44.91,9.11 180 top
D10  50.41,5.74 180 top
D11  50.42,4.3 180 top
J2  32.19,7.52 0 top
K1  46.8,27.5 0 top
K2  57.27,27.5 0 top
K3  KEY_36*3.5  [KEY_3*6*3.5]  0.35,26.69 90 top
K4  KEY_36*3.5  [KEY_3*6*3.5]  0.36,4.41 90 top
K5  7.04,15.6 90 top
L1  60.26,9.97 90 top
L2  38.91,21.02 0 top
L3  21.14,22.82 270 top
L4  17.22,22.34 0 top
P1  35.54,26.84 180 top
P2  16.35,4.14 0 top
P3  25.31,4.91 0 bottom
P4  46.15,6.73 0 bottom
P5  33.68,13.48 180 bottom
P6  40.16,12.54 0 bottom
P7  40.43,6.39 0 bottom
P8  42.36,3.42 0 bottom
P9  57.58,13.36 0 bottom
P24  31.76,27.78 0 bottom
P25  34.33,27.72 0 bottom
P26  39.51,27.15 0 bottom
P27  36.95,27.87 0 bottom
P32  20.1,4.5 0 bottom
P33  17.6,4.61 0 bottom
P34  15.1,4.45 0 bottom
P35  12.61,4.5 0 bottom
P36  41.52,19.13 0 bottom
P37  43.76,15.99 0 bottom
P42  44.84,21.51 0 bottom
P48  46.13,9.6 0 bottom
P49  54.47,15.21 0 bottom
P50  50.24,17.91 0 bottom
P51  42.59,13.68 0 bottom
P52  50.01,20.37 0 bottom
P53  50.38,22.92 0 bottom
P54  47.02,15.08 0 bottom
P55  44.78,13.54 0 bottom
P56  53.38,21.61 0 bottom
P57  54.11,18.59 0 bottom
P58  47.64,20.24 0 bottom
P60  49.4,11.96 0 bottom
P61  50.98,9.95 0 bottom
P62  54.66,7.82 0 bottom
Q1  23.56,10.93 90 top
Q2  23.86,8.21 90 top
Q4  43.1,18.96 0 top
Q7  30.27,13.43 270 top
Q8  30.3,16.47 270 top
Q9  33.92,21.91 270 top
R1  30.94,10.99 270 top
R2  33.93,14.17 180 top
R3  33.93,15.22 180 top
R4  34.68,10.98 90 top
R5  59.44,4.01 90 top
R6  60.41,5.67 0 top
R7  31.08,19.05 0 top
R8  36.28,18.47 180 top
R9  25.83,8.52 270 top
R10  32.49,10.98 90 top
R11  33.58,10.97 90 top
R12  38.38,7.8 180 top
R13  56.62,11.28 0 top
R14  56.62,10.22 180 top
R15  25.52,10.64 270 top
R16  21.15,10.31 0 top
R17  21.94,9.18 180 top
R18  31.27,22.85 0 top
R23  54.53,23.49 0 top
R24  44.84,18.33 90 top
R27  9.51,22.96 0 top
R28  9.52,9.79 0 top
R29  9.49,19.13 0 top
R30  9.52,14.3 0 top
R31  9.52,17.56 180 top
R32  28.32,16.68 90 top
R33  28.63,10.7 180 top
R34  32.34,13.43 270 top
R35  32.33,15.49 90 top
R43  21.96,15.14 90 top
R44  26.73,17.82 90 top
U1  16.12,11.02 180 top
U2  57.51,8.09 90 top
U3  50.2,15.61 0 top
U4  38.56,15.11 180 top
U5  33.74,18.95 0 top
U6  38.85,10.12 180 top
U7  16.92,17.06 270 top
U8  50.15,2.35 270 top
U9  45.85,4.68 0 top
U$6  [LOGO-1]  4.42,26.84 0 top
U$15  [LOGO-MIN]  10.71,27.48 0 top
X1  24.59,16.77 270 top

### Tracks (layer width: path | path; a pad name or v marks a point on that pad's centre or on a via)
3V3  (via drill 0.3, 0.5)
  Top 0.203: U3.15 48.87,14.36 | 48.87,14.36 49.31,14.36 51.24,16.29 C24.1 | U3.16 48.37,13.86 48.87,14.36 | U7.20 13.13,17.66 11.69,16.22 C40.2 9.96,16.25 9.97,16.26 | U7.46 20.67,15.66 21.12,15.21 21.12,14.54 C46.2 | U7.56 20.32,19.42 U7.55 | R6.2 60.32,6.21 59.51,6.21 v58.95,5.65
  Top 0.4: v27,8.4 26.67,8.07 R9.2 25.32,7.56 Q2.1 23.8,8.58 23.8,9.57 Q1.1 24.6,10.19 R15.2
  Top 0.5: C8.2 57.79,12 R13.2 | L2.1 37.29,21 C22.1 35.7,21 35.65,20.96 35.24,20.96 v35.13,20.85 | v9.96,8.73 R28.2 R30.2 9.97,16.26 R31.1 9.94,17.59 R29.2 9.96,19.15 R27.2 10.42,23.42 C36.2 C14.2 C9.2 16.78,23.4 L4.1 | R23.2 56.45,22.02 v56.45,17.41 56.45,13.29 56.55,13.19 | v54.08,17.43 C24.1 | 27.57,19.4 v27.59,19.38 | 27.57,19.4 C47.2 20.34,19.4 20.32,19.42 | C46.2 26.81,13.22 28.11,11.92 v28.2,11.92 28.18,11.9 R33.2 28.18,9.58 v27,8.4 | v33.96,20.85 33.96,22.68 34.44,23.15 35.54,23.15 36.54,24.15 P1.2 v36.54,26.91 | v30.44,17.39 30.17,17.12 Q8.1 R32.2 27.57,17.88 27.57,19.4 | Q7.1 30.01,14.77 v30.44,14.77
  Top 1: L1.2 60.26,11.05 59.31,12 C8.2 57.23,13.19 56.55,13.19 v56.02,13.19
  Bottom 0.203: 51.83,9 52.21,9 56.39,4.82 58.12,4.82 v58.95,5.65
  Bottom 0.5: v54.08,17.43 54.1,17.41 v56.45,17.41 | v35.13,20.85 v33.96,20.85 28.07,20.85 27.59,20.37 v27.59,19.38 | v30.44,17.39 v30.44,14.77 30.44,13.99 28.37,11.92 v28.2,11.92 | v36.54,26.91 36.54,27.46 P27.P$1 | P9.P$1 56.19,13.36 v56.02,13.19 | P48.P$1 46.13,8.43 46.16,8.4
  Bottom 1: v9.96,8.73 10.29,8.4 v27,8.4 46.16,8.4 51.23,8.4 51.83,9 v56.02,13.19
3V3_RX  (via drill 0.3)
  Top 0.203: U7.50 21.45,17.26 22.62,16.09 22.62,15 23.48,14.14 27.05,14.14 27.36,14.44 | 27.36,14.44 28.32,15.41 R32.1 28.94,16.23 Q8.2 | Q2.2 24.91,8.97 R9.1 26.32,9.46 v26.32,12.37 | v28.36,13.81 28.36,13.88 27.79,14.44 27.36,14.44
  Bottom 0.203: v28.36,13.81 28.07,13.81 26.87,12.6 26.55,12.6 v26.32,12.37
3V3_TX  (via drill 0.3)
  Top 0.203: R43.1 22.9,13.74 27.11,13.74 27.98,12.87 28.23,12.87 | 28.23,12.87 29.23,12.87 Q7.2 29.08,12.54 R33.1 | R15.1 25.03,11.58 Q1.2 25.13,12.2 v25.43,12.2 | v28.24,12.86 28.23,12.87
  Bottom 0.203: v25.43,12.2 25.54,12.2 25.98,11.76 27.14,11.76 v28.24,12.86
5V  (via drill 0.3)
  Top 0.4: v21.49,6.01 R17.2 21.49,10.2 R16.2
  Top 0.5: D7.+ D8.+ 52.79,2.95 52.19,2.35 U8.3 50.24,3.21 v50.24,4.32 | P2.2 v16.3,6.01
  Bottom 0.5: v50.24,4.32 49.56,5 26.73,5 25.73,6.01 v21.49,6.01 v16.3,6.01 15.1,4.81 P34.P$1
5V_RX
  Top 0.203: R34.1 31.89,13.43 Q7.3
  Top 0.254: R2.2 32.64,14.18 R34.1
5V_RX0  (via drill 0.3)
  Top 0.203: R17.1 22.39,8.73 Q2.3 22.91,6.5 v21.54,5.13 20.98,5.13 P2.4
  Bottom 0.203: v21.54,5.13 20.91,4.5 P32.P$1
5V_TX
  Top 0.203: R35.1 31.25,16.12 Q8.3
  Top 0.254: R3.2 33.3,15.04 R35.1
5V_TX0  (via drill 0.3)
  Top 0.203: Q1.3 21.32,10.93 R16.1 20.7,9.81 19.91,9.02 19.39,9.02 18.79,8.42 18.79,6.91 | 18.79,6.91 v18.79,5.25 | P2.3 17.89,6.01 18.79,6.91
  Bottom 0.203: v18.79,5.25 18.15,4.61 P33.P$1
BAT  (via drill 0.3)
  Top 0.203: v41.83,6.89 41.83,6.94
  Top 0.5: U6.3 41.65,11.12 42.51,10.26 C5.2 42.51,7.63 | 44.42,5.63 U9.3 | 44.42,2.74 44.82,2.34 D3.+ 46.29,2.34 v46.31,2.36 | 44.42,2.74 44.42,5.63 | 44.42,5.63 44.42,6.19 42.98,7.63 42.51,7.63 | v51.61,3.32 D11.+ | B1.1 42.2,1.67 43.27,2.74 44.42,2.74 | 41.83,6.94 42.51,7.63
  Bottom 0.203: P7.P$1 40.93,6.89 v41.83,6.89
  Bottom 0.5: v51.61,3.32 v51.6,3.33 47.33,3.33 46.36,2.36 v46.31,2.36
BOOT  (via drill 0.3, 0.35)
  Top 0.203: v42.1,26.18 43.5,26.18 K1.2 | v19.45,19.13 19.23,19.35 18.54,19.35 17.92,19.97 U7.5 | v26.95,21.89 28.2,20.64 28.2,19.24 29.15,18.29 29.17,18.3 U5.3
  Bottom 0.203: v42.1,26.18 41.46,25.54 38.03,25.54 34.64,22.15 27.69,22.15 27.43,21.89 v26.95,21.89 25.54,21.89 22.92,19.27 19.59,19.27 v19.45,19.13
D+
  Top 0.203: J2.A6 31.94,8.94 32.17,9.17 32.7,9.17 32.94,8.93 | J2.B6 32.94,8.93 | 32.94,8.93 32.94,9.88 R11.1
D-
  Top 0.203: J2.A7 32.44,7.16 32.16,6.88 31.71,6.88 31.44,7.15 J2.B7 31.44,9.48 R10.1
DTR  (via drill 0.3, 0.35)
  Top 0.203: U5.4 35.1,18.3 35.7,17.7 37.76,17.7 | U4.4 40.75,16.11 39.16,17.7 37.76,17.7 | R7.1 30.63,19.6 v30.9,19.87 | 37.76,17.7 37.76,18.32 v37.49,18.59
  Bottom 0.203: v30.9,19.87 34.11,19.87 35.39,18.59 v37.49,18.59
EN_RESET  (via drill 0.35)
  Top 0.203: v35.74,19.46 35.6,19.6 U5.6 | v52.37,25.03 52.54,25.03 R23.1 C2.2 54.09,26.23 K2.2 | U7.4 18.32,20.11 18.56,19.86 18.63,19.79 19.7,19.79 19.93,20.02 23.27,20.02 24.16,20.92 v26.84,20.92
  Bottom 0.203: v35.74,19.46 35.74,21.79 | 35.74,21.79 35.74,22.75 38.02,25.03 v52.37,25.03 | 35.74,21.79 27.84,21.79 26.96,20.92 v26.84,20.92
GDR  (via drill 0.3)
  Top 0.203: U3.2 46.98,20.82 45.86,20.82 44.01,18.97 v43.68,18.97 43.41,18.97 Q4.1
  Bottom 0.203: P36.P$1 43.51,19.13 v43.68,18.97
GND  (via drill 0.3, 0.35)
  Top 0.9: C38.1 22.78,24.26
  Top 1: 22.78,24.26 23.3,24.78 ANT1.GND
  other vias: 5.07,22.76 6.78,22.74 26.22,20.19 20.18,24.34 20.17,23.42 20.31,22.55 20.18,21.58 22.05,23.18 22.05,22.27 22.58,20.66 23.78,23.85 12.69,14.59 12.51,10.16 12.59,13.75 10.83,18.17 19.47,18.07 19.47,16.84 14.38,16.07 21.74,17.81 27.48,16.45 27.48,15.43 37.14,17.08 37.18,13.11 31.63,17.59 30.01,24.05 31.2,24.05 32.65,12.22 26.75,7.25 37.71,6.56 38.97,18.37 40.29,18.38 57.57,9.2 59.8,6.89 59.78,7.81 57.6,8.37 4.1,18.97 4.1,15.69 3.75,12.34 4.1,8.17 3.93,4.76 6.58,5.42 14.91,2.05 19,1.91 17.04,2.05 24.07,22.56 31.41,3.11 33.26,2.98 41.22,2.44 53.45,6.36 51.81,6.68 38.24,11.94 42.64,15.21 42.62,16.66 60.07,14.7 57.99,17.73 58.04,14.45 58.1,21.59 58.14,24.18 54.42,22.05 54.4,21.08 52.53,22.93 47.19,23.96 37.46,29.03 34.22,29.05 22.83,12.25 39.74,24.37 14.36,15.23 11.92,24.35 13.37,24.33 52.64,6.84 16.62,18.71 17.46,17.76 18.51,16.74 17.77,18.74 18.5,17.77 15.94,10.55 38,16.22 37.98,15.2 37.98,14.08 39.17,16.22 39.18,15.13 39.17,14.03 41.24,3.99 23.67,12.26
  pour Top (rank 2): -0.88,31.77 -0.88,-1.08 64.47,-1.08 arc-45 64.59,-1.13 64.59,31.31 arc45 64.3,32.01 63.97,32.34 28.05,32.34 arc45 28,32.32 28,25.22 arc45 28.03,25.15 4.6,25.15 arc-45 4.55,25.17 4.55,31.88 -0.62,31.88 arc45 -0.89,31.77
  pour Bottom (rank 2): -0.87,31.93 -0.87,-0.95 -0.91,-0.99 64.58,-0.99 64.63,-1.04 64.63,31.66 64.04,32.25 27.98,32.25 27.98,25.13 4.54,25.13 4.54,31.9 -0.84,31.9
IO1_EXIT  (via drill 0.3)
  Top 0.203: v9.09,13.09 9.11,13.07 9.11,9.83 R28.1 9.07,9.57 6.01,6.51 K4.2 | U7.6 17.52,21.08 v17.85,21.41
  Bottom 0.203: v9.09,13.09 10.05,14.05 10.05,18.99 11.6,20.54 16.98,20.54 v17.85,21.41
IO2_MENU  (via drill 0.3)
  Top 0.203: K3.1 8.43,24.59 9.03,23.99 9.03,22.99 R27.1 9.04,22.94 v9.04,22.1 | U7.7 17.12,21.34 v16.95,21.51
  Bottom 0.203: v16.95,21.51 16.95,21.73 15.99,22.69 9.63,22.69 v9.04,22.1
IO4_DOWN  (via drill 0.3)
  Top 0.203: v9.1,15.08 9.1,14.33 R30.1 7.37,12.6 K5.1 | v16.01,21.76 16.32,21.45 16.32,21.18 U7.9
  Bottom 0.203: v16.01,21.76 15.15,20.91 11.35,20.91 9.68,19.24 9.68,16.19 9.1,15.61 v9.1,15.08
IO5_CONF  (via drill 0.3)
  Top 0.203: v9.06,18.33 R31.2 8.11,16.6 K5.4 | U7.10 15.93,20.96 15.19,21.7 v15.19,22.04
  Bottom 0.203: v15.19,22.04 14.54,21.4 11.29,21.4 9.06,19.17 v9.06,18.33
IO6_UP  (via drill 0.3)
  Top 0.203: U7.11 15.53,20.83 v14.32,22.04 | K5.2 8.39,18.6 8.92,19.13 R29.1 9.04,20.08 v9.07,20.11
  Bottom 0.203: v14.32,22.04 14.31,22.03 11.04,22.03 9.12,20.11 v9.07,20.11
IO7_LCD_3.3_CTL  (via drill 0.3)
  Top 0.203: U7.12 15.12,19.97 v15.49,19.6 | R18.1 29.92,22.85 v29.9,22.87
  Bottom 0.203: v15.49,19.6 19.06,19.6 19.2,19.74 22.85,19.74 25.98,22.87 v29.9,22.87
IO9_BUSY  (via drill 0.3)
  Top 0.203: U7.14 12.15,20.46 11.65,19.96 v11.65,19.51 | v50.21,16.85 49.7,17.36 U3.9
  Bottom 0.203: 50.21,16.76 50.21,15.04 44.47,9.3 22.1,9.3 14.47,16.93 12.19,16.93 11.51,17.61 11.51,19.37 v11.65,19.51 | 50.21,16.76 v50.21,16.85 | P50.P$1 50.24,16.79 50.21,16.76
IO10_RES  (via drill 0.3, 0.35)
  Top 0.203: v45.72,15.74 45.72,16.29 46.29,16.86 U3.10 | U7.15 14.43,19.66 v14.63,19.46
  Bottom 0.203: 43.15,13.07 45.72,15.65 v45.72,15.74 | 43.15,13.07 41.38,11.31 22.89,11.31 14.74,19.46 v14.63,19.46 | P51.P$1 43.15,13.12 43.15,13.07
IO11_SPI_MOSI  (via drill 0.3, 0.35)
  Top 0.203: U3.14 47.01,14.85 45.84,14.85 v45.82,14.83 | v14.36,18.63 14.4,18.68 14.4,18.77 13.91,19.26 U7.16
  Bottom 0.203: 45.41,12.88 43.4,10.87 22.55,10.87 14.79,18.63 v14.36,18.63 | 45.41,12.88 45.82,13.29 v45.82,14.83 | P55.P$1 45.41,12.91 45.41,12.88
IO12_SPI_CLK  (via drill 0.3)
  Top 0.203: U7.17 13.15,18.86 12.5,19.51 v12.5,19.81 | v46.5,16.17 46.5,15.79 46.93,15.36 U3.13
  Bottom 0.203: 46.5,15.09 46.5,13.2 43.75,10.45 22.46,10.45 14.91,18 14.13,18 12.5,19.63 v12.5,19.81 | 46.5,15.09 v46.5,16.17 | P54.P$1 46.51,15.08 46.5,15.09
IO13_D/C  (via drill 0.3)
  Top 0.203: U7.18 13.03,18.46 12.64,18.85 v12.3,18.85 | v49.59,16.24 49.47,16.36 U3.11
  Bottom 0.203: v12.3,18.85 11.87,18.42 11.87,17.76 12.34,17.29 14.62,17.29 22.24,9.67 44.1,9.67 49.67,15.23 49.67,16.16 v49.59,16.24 49.49,16.34 49.49,19.85 P52.P$1
IO14_CS  (via drill 0.3)
  Top 0.203: v12.5,17.99 v12.5,18 12.56,18.06 U7.19 | v48.96,15.64 48.74,15.86 U3.12
  Bottom 0.203: v48.96,15.64 49,15.6 | 49,15.6 49,15.13 43.94,10.08 22.33,10.08 14.77,17.64 12.84,17.64 v12.5,17.99 | 49,15.6 49,15.97 48.98,15.99 48.98,21.52 P53.P$1
IO19_LED  (via drill 0.3)
  Top 0.203: U7.25 12.8,15.66 11.66,14.52 v11.66,13.16 | v58.63,4.46 R5.2
  Bottom 0.203: v11.66,13.16 11.66,11.64 9.12,9.1 9.12,8.27 10.24,7.15 25.3,7.15 26.87,5.58 37.75,5.58 39.67,7.5 53.2,7.5 56.24,4.46 v58.63,4.46
IO40  (via drill 0.3)
  Top 0.203: U7.45 19.8,15.26 v19.51,15.55 | v29.69,20.01 29.69,20.19 28.63,21.25 28.63,23.86 29.89,25.12 v31.17,25.12 P1.4
  Bottom 0.203: v19.51,15.55 22.08,12.98 26.68,12.98 29.69,16 v29.69,20.01 | P24.P$1 31.76,26.38 31.17,25.79 v31.17,25.12
IO41  (via drill 0.3)
  Top 0.203: U7.47 v21.16,16.06 | v28.83,19.82 28.83,20.52 28.25,21.1 28.25,24.28 30.66,26.69 v33.58,26.69 33.93,26.69 34.54,26.09 P1.3
  Bottom 0.203: v28.83,19.82 29.27,19.38 29.27,16.11 26.49,13.34 22.23,13.34 21.16,14.4 v21.16,16.05 v21.16,16.06 | P25.P$1 33.58,26.97 v33.58,26.69
LCD_GND  (via drill 0.35)
  Top 0.203: U3.6 U3.7 U3.8 | U3.17 46.81,13.36
  Top 0.5: Q9.3 C22.2 36.14,22.8 36.78,23.44 v41.31,23.44 | C28.2 C20.2 C27.2 C29.2 C26.2 C25.2 C24.2 54.98,18.3 | 54.98,18.3 54.98,19.3 C23.2 | 54.98,18.3 54.94,18.34 45.76,18.34 v45.74,18.36 U3.7 45.47,18.36 44.99,17.88 R24.1 44.84,14.55 46.03,13.36 46.81,13.36 | v45.93,23.03 45.86,22.96 D5.-
  Bottom 0.5: v41.31,23.44 45.52,23.44 v45.93,23.03 45.73,22.83 45.73,21.51 | P42.P$1 45.73,21.51 | v45.74,18.36 45.73,18.37 45.73,21.51
N$1
  Top 0.203: R7.2 31.63,18.95 U5.2
N$2
  Top 0.5: U8.1 49.2,4.28 D11.- D10.-
N$3
  Top 0.203: R8.2 35.35,18.95 U5.5
N$5
  Top 0.254: R1.2 J2.A5
N$6  (via drill 0.3)
  Top 0.203: D9.- 43.91,9.11 46.99,6.03 46.99,5.82 | D8.- v52.96,4.21 v52.95,4.2 | 46.99,5.82 v46.96,5.79 | 46.99,5.82 46.99,5.52 U9.1
  Bottom 0.203: v52.95,4.2 51.33,5.82 46.99,5.82 v46.96,5.79
N$7
  Top 0.203: R18.2 Q9.1
N$8
  Top 0.254: U4.8 34.49,15.11 R3.1
N$9
  Top 0.203: R13.1 R14.2 55.54,9.59 55.54,7.91 U2.5
N$10
  Top 0.254: U4.10 35.83,13.08 C3.2
N$11
  Top 0.7: U2.3 58.75,9.08 L1.1
N$12
  Top 0.254: J2.B5 33.93,9.78 R4.1
N$16
  Top 0.254: R12.2 37.58,8.06 U6.5
N$25
  Top 0.203: R6.1 59.96,4.08 R5.1 60.09,3.56 D1.+
N$30
  Top 0.254: C38.2
  Top 0.5: L3.1 C38.2 | C38.2 ANT1.1
N$31
  Top 0.203: U7.1 19.78,20.72 20.63,20.72 20.85,20.94 21.2,21.29 C39.2
  Top 0.254: 21.2,22.31 L3.2
  Top 0.5: C39.2 21.2,22.31
  pour Top: 19.42,20.81 19.43,20.19 19.61,20.19 21.49,20.98 21.5,22.64 20.79,22.64 20.79,21.14
N$33
  Top 0.203: U7.3 18.73,22.19 19.12,21.8 U7.2
  Top 0.254: L4.2 18.58,22.34 C37.2 18.73,22.19
N$36
  Top 0.254: U4.9 34.44,14.11 R2.1
N$37
  Top 0.203: U7.54 26.15,18.86 R44.2
N$55
  Top 0.5: C21.1 41.74,22.28 D5.+ D4.-
N$56
  Top 0.5: L2.2 40.7,20.83 C21.2 | C21.2 42.63,19.94 43.07,19.94 Q4.3 | C21.2 42.27,20.83 D6.+
N$63
  Top 0.203: U7.49 21.28,16.86 21.96,16.18 R43.2
N$65
  Top 0.203: U7.53 22.26,18.46 C44.2 23.56,18.1 X1.1
N$66
  Top 0.203: R44.1 26.73,16.06 C45.1 25.76,16.04 X1.3
PREVGH  (via drill 0.3, 0.35)
  Top 0.203: D6.- 45.41,21.42 45.75,21.76 48.91,21.76 48.92,21.75 50.2,21.75 50.21,21.75 50.42,21.75 v51.97,20.2 | v51.96,13.51 53.26,13.51 54.08,12.69 C29.1 51.02,12.4 49.98,11.36 U3.21
  Bottom 0.203: v51.96,13.51 v51.97,13.52 v51.97,20.2 P56.P$1
PREVGL  (via drill 0.35)
  Top 0.203: D4.+ 45.03,24.59 51.83,24.59 53.14,23.28 v53.14,19.99 | v52.3,10.95 53.08,10.95 54.09,9.94 C20.1 52.52,9.54 51.7,10.36 U3.23
  Bottom 0.203: v52.3,10.95 52.66,11.31 52.66,18.58 | P57.P$1 52.66,18.58 | v53.14,19.99 52.66,19.51 52.66,18.58
RESE  (via drill 0.3)
  Top 0.203: U3.3 46.38,20.36 44.84,18.82 R24.2 44.07,18.01 Q4.2 v43.75,17.01
  Bottom 0.203: v43.75,17.01 v43.76,17 P37.P$1
RTS
  Top 0.203: U4.6 35.41,17.11 34.67,17.85 34.04,17.85 33.62,18.27 33.62,19.28 33.3,19.6 U5.1 32.82,19.69 33.26,20.12 35.98,20.12 36.58,19.53 36.58,18.62 R8.1
SPICLK
  Top 0.203: U7.33 15.92,12.73 14.61,11.42 U1.6
SPICS0  (via drill 0.3)
  Top 0.203: v15.95,14.53 15.52,14.11 U7.32 | v19,10.14 18.68,9.82 U1.1
  Bottom 0.203: v15.95,14.53 16.33,14.53 19.66,11.2 19.66,10.8 v19,10.14
SPID  (via drill 0.3)
  Top 0.203: U7.35 16.73,13.3 16.95,13.07 v16.95,12.41 | U1.5 14.55,12.22 v15.07,12.74
  Bottom 0.203: v16.95,12.41 16.62,12.74 v15.07,12.74
SPIHD
  Top 0.203: U7.30 14.72,13.29 14.52,13.09 14.01,13.09 13.34,12.43 13.34,10.95 13.67,10.62 U1.7
SPIQ
  Top 0.203: U7.34 16.32,11.89 16.63,11.58 17.2,11.58 17.37,11.4 17.37,10.95 17.7,10.62 U1.2
SPIWP  (via drill 0.3)
  Top 0.203: U7.31 15.12,14.39 v14.97,14.54 | v18.97,11.02 18.89,10.94 18.74,10.94 18.26,11.42 U1.3
  Bottom 0.203: v14.97,14.54 15.59,13.92 16.34,13.92 18.97,11.29 v18.97,11.02
USB_D+  (via drill 0.3)
  Top 0.203: U4.1 40.45,13.11 40.11,12.77 38.77,12.77 | R11.2 33.58,11.48 34.25,12.14 37.58,12.14 38.2,12.77 38.75,12.77 38.77,12.77 | v38.99,12.55 38.77,12.77
  Bottom 0.203: P6.P$1 v38.99,12.54 v38.99,12.55
USB_D-  (via drill 0.3)
  Top 0.203: U4.2 40.9,14.11 39.96,13.17 38.1,13.17 37.43,12.5 33.79,12.5 33.58,12.29 | R10.2 | R10.2 32.72,11.43 33.58,12.29 | v33.55,12.31 33.58,12.29
  Bottom 0.203: P5.P$1 33.55,13.36 v33.55,12.31
VBUS  (via drill 0.3, 0.35)
  Top 0.203: J2.A4 29.79,8.17 | 47.93,7.12 47.93,7.09
  Top 0.254: J2.B9 J2.A4 29.78,7.88 | J2.B4 J2.A9 | J2.A9 34.6,7.88 | J2.A9 34.58,8.18
  Top 0.5: 29.78,7.88 29.78,7.04 31.15,5.67 33.2,5.67 34.6,7.07 34.6,7.88 | D2.+ v47.92,6.82 | 47.93,7.09 47.92,7.08 v47.92,6.82 | 34.58,8.18 34.58,8.96 36.1,10.48 C4.2 36.94,10.48 U6.4 38.68,11.12 39.46,11.9 43.31,11.9 D9.+ 46.11,9.1 47.93,7.28 47.93,7.12 | v34.37,17.2 34.39,17.18 C10.1 34.68,16.11 U4.7 | v32.32,16.93 v32.33,16.92 R35.2 | 29.79,8.17 29.79,11.6 30.87,12.68 31.37,12.68 | R34.2 32.15,12.98 31.85,12.68 31.37,12.68 | v31.37,12.57 31.37,12.68 | D10.+ 50.55,6.8 47.94,6.8 v47.92,6.82
  Bottom 0.5: v34.37,17.2 34.32,17.25 32.64,17.25 v32.32,16.93 31.37,15.98 v31.37,12.57 | v47.92,6.82 46.24,6.82 P4.P$1
VCOM  (via drill 0.3)
  Top 0.203: U3.24 51.63,9.86 53.03,8.46 53.33,8.46 | 53.33,8.46 C28.1 | v53.32,8.76 v53.33,8.76 53.33,8.46
  Bottom 0.203: P62.P$1 53.72,8.76 v53.32,8.76
VDD  (via drill 0.3)
  Top 0.203: C25.1 v53.27,15.21 50.87,15.21 48.52,12.86 U3.18
  Bottom 0.203: P49.P$1 v53.27,15.21
VDD_SPI
  Top 0.203: C41.2 13.99,13.66 U7.29
  Top 0.3: C42.2 12.65,11.03 13.86,9.82 U1.8
  Top 0.5: C41.2 C42.2
VDHR  (via drill 0.3)
  Top 0.203: v46.49,19.36 U3.5 54.02,19.36 C23.1
  Bottom 0.203: P58.P$1 47.07,20.24 46.49,19.66 v46.49,19.36
VIN
  Top 0.5: U9.2 46.67,3.56 47.78,3.56 D2.- 47.92,3.27 47.88,3.23 47.88,2.64 47.63,2.39 D3.- 48.28,1.69 U8.2 49.33,1.57 54.63,1.57 56.41,3.35 | U2.4 56.31,8.55 57.72,7.14 U2.1 58.71,6.51 57.96,5.76 C7.2 57.96,4.9 56.41,3.35 | D7.- 56.41,3.35
VSH  (via drill 0.3)
  Top 0.203: U3.20 48.44,11.86 v49.68,13.1 50.73,14.15 C26.1
  Bottom 0.203: v49.68,13.1 49.4,12.82 P60.P$1
VSL  (via drill 0.3)
  Top 0.203: C27.1 53.81,11.59 v51.39,11.59 50.78,11.59 50.05,10.86 U3.22
  Bottom 0.203: P61.P$1 50.98,11.18 v51.39,11.59

### Text on the board
tPlace: ESP32 Display-2.13(E) inch | SKU:DIE01021S | V1.0 | IO40 / IO41 / 3V3 / GND | GND / 5V / TXD / RXD | - | + | Power in